# EasyEDA Pro project ProDoc_TwinWave_2026-01-11.epro

# Schematic TwinWave
Board Name: TwinWave; Create Date: 2025-08-05; Page Name: Main; Project Name: TwinWave - WiFi & SubGHz Module; Schematic Name: TwinWave; Update Date: 2026-01-07; Company: Created by 0xM4R71N; Drawn: 0xM4R71N; Page Size: A3; Reviewed: 0xM4R71N; Version: V2.1
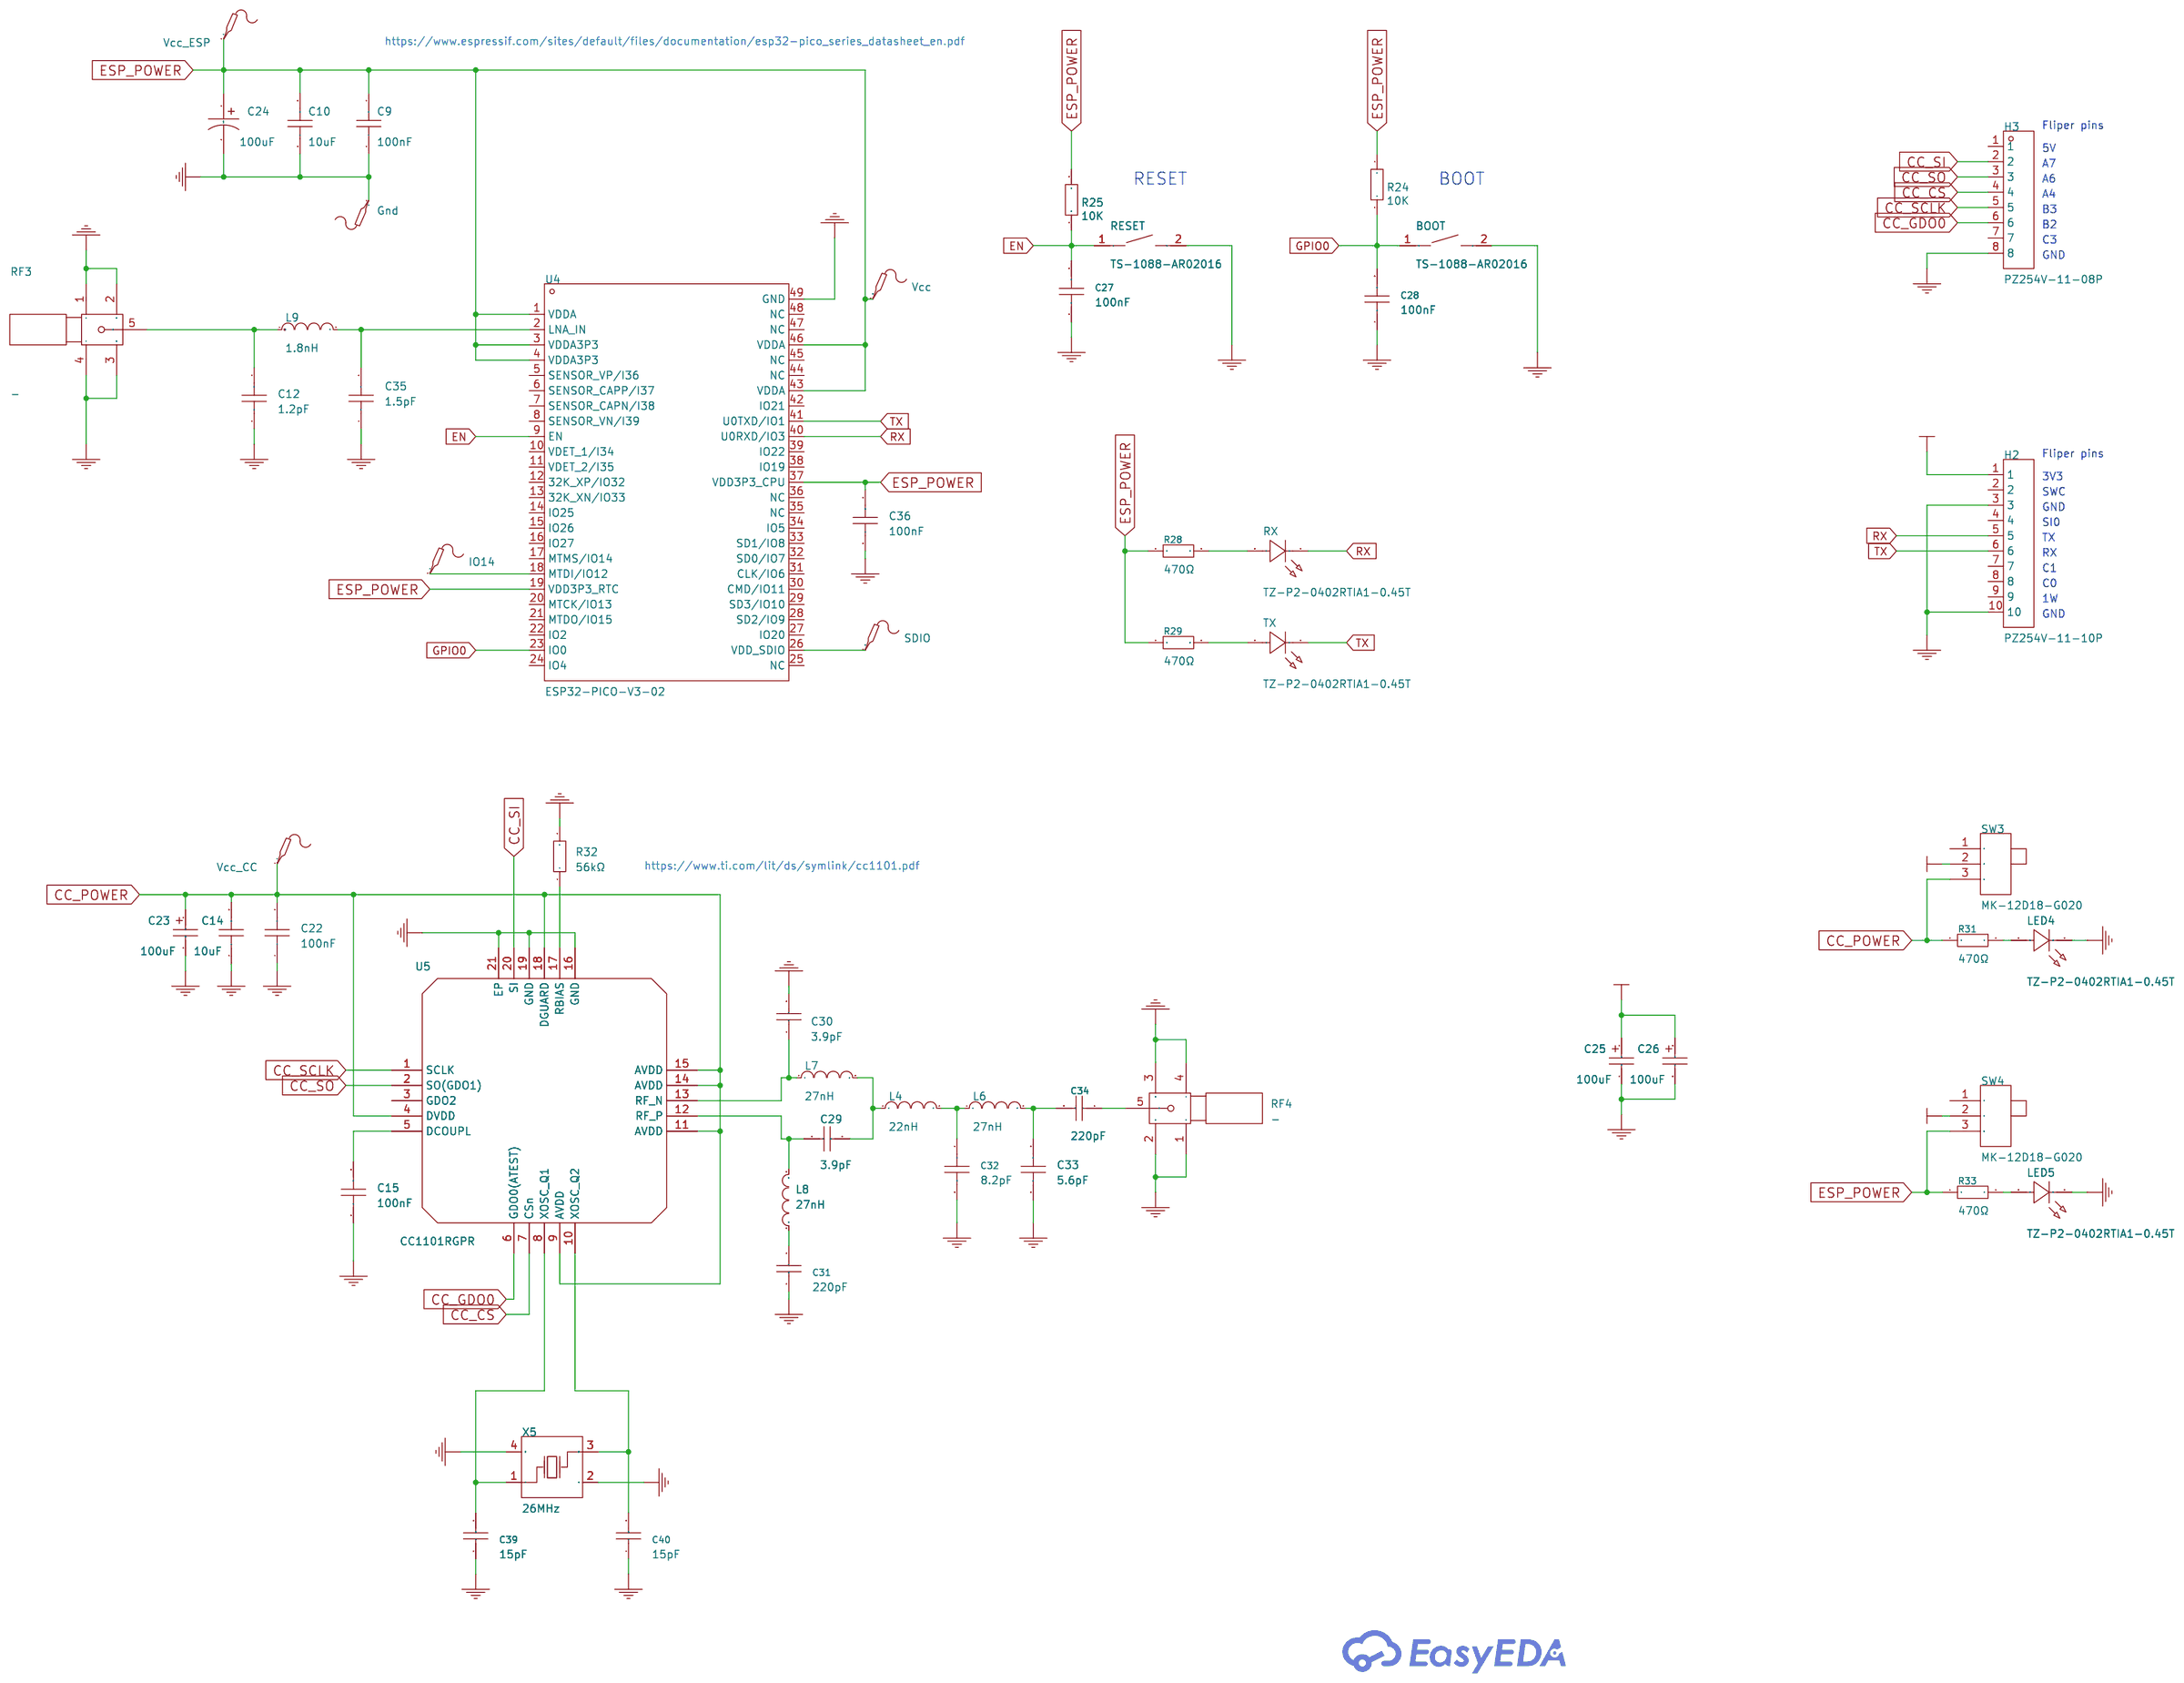
[diagram p0: schematic sheet]

## Parts
BOOT  TS-1088-AR02016  [SW-SMD_L3.9-W3.0-P4.45]
C9  100nF  [C0603]
C10  10uF  [C0603]
C12  1.2pF  [C0201]
C14  10uF  [C0603]
C15  100nF  [C0603]
C22  100nF  [C0603]
C23  100uF  [CASE-B_3528]
C24  100uF  [CASE-B_3528-1]
C25  100uF  [CASE-B_3528]
C26  100uF  [CASE-B_3528]
C27  100nF  [C0402]
C28  100nF  [C0402]
C29  3.9pF  [C0402]
C30  3.9pF  [C0402]
C31  220pF  [C0402]
C32  8.2pF  [C0402]
C33  5.6pF  [C0402]
C34  220pF  [C0402]
C35  1.5pF  [C0201]
C36  100nF  [C0603]
C39  15pF  [C0402]
C40  15pF  [C0402]
Gnd  -  [Test-Point-0.5mm]
H2  PZ254V-11-10P  [HDR-TH_10P-P2.54-V-M]
H3  PZ254V-11-08P  [HDR-TH_8P-P2.54-V-M]
IO14  -  [Test-Point-0.5mm]
L4  22nH  [L0402]
L6  27nH  [L0402-RD]
L7  27nH  [L0402-RD]
L8  27nH  [L0402-RD]
L9  1.8nH  [L0201-RD]
LED4  TZ-P2-0402RTIA1-0.45T  [LED0402-RD_RED]
LED5  TZ-P2-0402RTIA1-0.45T  [LED0402-RD_RED]
R24  10K  [R0603]
R25  10K  [R0603]
R28  470Ω  [R0402]
R29  470Ω  [R0402]
R31  470Ω  [R0402]
R32  56kΩ  [R0402]
R33  470Ω  [R0402]
RESET  TS-1088-AR02016  [SW-SMD_L3.9-W3.0-P4.45]
RF3  -  [SMA-SMD_BWSMA-KE-P001]
RF4  -  [SMA-SMD_BWSMA-KE-P001]
RX  TZ-P2-0402RTIA1-0.45T  [LED0402-RD_RED]
SDIO  -  [Test-Point-0.5mm]
SW3  MK-12D18-G020  [SW-TH_MK-12D18-G040]
SW4  MK-12D18-G020  [SW-TH_MK-12D18-G040]
TX  TZ-P2-0402RTIA1-0.45T  [LED0402-RD_RED]
U4  ESP32-PICO-V3-02  [QFN-48_L7.0-W7.0-P0.50-BL-EP5.1]
U5  CC1101RGPR  [QFN-20_L4.0-W4.0-P0.5-TL-EP]
Vcc  -  [Test-Point-0.5mm]
Vcc_CC  -  [Test-Point-0.5mm]
Vcc_ESP  -  [Test-Point-0.5mm]
X5  26MHz  [CRYSTAL-SMD_4P-L3.2-W2.5-BL]

## Library data of the parts
BOOT RESET = TS-1088-AR02016: Circuit:SPST Actuator Style:Round Button Operating Force:160gf Mounting Style:Brick nogging Switch Length:4mm Switch Width:3mm Switch Height:2mm Strike Gundam:不带 Contact Current:50mA Voltage Rating (DC):12V Insulation Resistance:100MΩ Actuator/Cap Color:B; LCSC Part Name: 4*3*2mm 立贴 轻触开关; Supplier Part: C720477; Manufacturer: XUNPU(讯普); Supplier Footprint: SMD; JLCPCB Part Class: Basic Part; Datasheet: https://atta.szlcsc.com/upload/public/pdf/source/20200810/C720475_60D09DD6C54279ADDB2DC25100F1CC11.pdf; Supplier: LCSC; Circuit: SPST; Actuator Style: Round Button; Operating Force: 160gf; Mounting Style: Brick nogging; Switch Length: 4mm; Switch Width: 3mm; Switch Height: 2mm; Strike Gundam: 不带; Contact Current: 50mA; Voltage Rating (DC): 12V; Insulation Resistance: 100MΩ; Actuator/Cap Color: Black; Pin Style: SMDSplicing; Mechanical Life: 10万次; Operating Temperature: -30℃~+80℃
C9 C15 C22 C36 = CC0603KRX7R9BB104: Capacitance:100nF Tolerance:±10% Tolerance:±10% Voltage Rating:50V Temperature Coefficient:X7R; LCSC Part Name: 100nF ±10% 50V; Supplier Part: C14663; Manufacturer: YAGEO(国巨); Supplier Footprint: 0603; JLCPCB Part Class: Basic Part; Datasheet: https://atta.szlcsc.com/upload/public/pdf/source/20250214/096C4C206003071F5D32E5F0D8E7F8DF.pdf; Supplier: LCSC; Tolerance: ±10%; Voltage Rating: 50V; Temperature Coefficient: X7R
C10 C14 = CL10A106MP8NNNC: Capacitance: Tolerance:±20% Tolerance:±20% Voltage Rated: Temperature Coefficient:; LCSC Part Name: 10uF ±20% 10V; Supplier Part: C85713; Manufacturer: SAMSUNG(三星); Supplier Footprint: 0603; JLCPCB Part Class: Extended Part; Datasheet: https://atta.szlcsc.com/upload/public/pdf/source/20160218/1457707763339.pdf; Supplier: LCSC; Tolerance: ±20%
C12 = GRM0335C1H1R2BA01D: Capacitance: Voltage Rated: Temperature Coefficient:; LCSC Part Name: 1.2pF 50V; Supplier Part: C85895; Manufacturer: muRata(村田); Supplier Footprint: 0201; JLCPCB Part Class: Extended Part; Datasheet: https://atta.szlcsc.com/upload/public/pdf/source/20200305/C490387_23319AE8C154DEB24C505E6C82A8106A.pdf; Supplier: LCSC
C23 C25 C26 = TAJB107K006RNJ: Capacitance:100uF Tolerance:±10% Tolerance:±10% Voltage Rating:6.3V Equivalent Series Resistance(ESR):1.7Ω@100kHz Operating Temperature:-55℃~+125℃ Operating Temperature:-55℃~+125℃; LCSC Part Name: 100uF ±10% 6.3V; Supplier Part: C16133; Manufacturer: Kyocera AVX; Supplier Footprint: CASE-B-3528-21(mm); JLCPCB Part Class: Basic Part; Supplier: LCSC; Tolerance: ±10%; Voltage Rating: 6.3V; Equivalent Series Resistance(ESR): 1.7Ω@100kHz; Operating Temperature: -55℃~+125℃
C24 = TPSB107K006R0250: Capacitance:100uF Tolerance:±10% Tolerance:±10% Voltage Rating:6.3V Current - Leakage:- Ripple Current:- Equivalent Series Resistance(ESR):250mΩ Operating Temperature:-55℃~+125℃ Operating Temperature:-55℃~+125℃; LCSC Part Name: 100uF ±10% 6.3V; Supplier Part: C597710; Manufacturer: Kyocera AVX; Supplier Footprint: 1210; JLCPCB Part Class: Extended Part; Supplier: LCSC; Tolerance: ±10%; Voltage Rating: 6.3V; Equivalent Series Resistance(ESR): 250mΩ; Operating Temperature: -55℃~+125℃
C27 C28 = CC0402KRX7R7BB104: Capacitance: Tolerance:±10% Tolerance:±10% Voltage Rated: Temperature Coefficient:; LCSC Part Name: 100nF ±10% 16V; Supplier Part: C60474; Manufacturer: YAGEO(国巨); Supplier Footprint: 0402; JLCPCB Part Class: Extended Part; Datasheet: https://atta.szlcsc.com/upload/public/pdf/source/20211223/9278FD768280B81DDBEF48FA36411A03.pdf; Supplier: LCSC; Tolerance: ±10%
C29 C30 = 0402CG3R9C500NT: Capacitance: Voltage Rated: Temperature Coefficient:; LCSC Part Name: 3.9pF 50V; Supplier Part: C1566; Manufacturer: FH(风华); Supplier Footprint: 0402; JLCPCB Part Class: Extended Part; Datasheet: https://atta.szlcsc.com/upload/public/pdf/source/20200305/C486355_26A10D38EF8C2A5C37091D0039909270.pdf; Supplier: LCSC
C31 C34 = CC0402JRNPO9BN221: Capacitance:220pF Tolerance:±5% Tolerance:±5% Voltage Rating:50V Temperature Coefficient:NP0; LCSC Part Name: 220pF ±5% 50V; Supplier Part: C107001; Manufacturer: YAGEO(国巨); Supplier Footprint: 0402; JLCPCB Part Class: Extended Part; Datasheet: https://item.szlcsc.com/datasheet/CC0402JRNPO9BN221/108217.html; Supplier: LCSC; Tolerance: ±5%; Voltage Rating: 50V; Temperature Coefficient: NP0
C32 = CC0402BRNPO9BN8R2: Capacitance: Voltage Rated: Temperature Coefficient:; LCSC Part Name: 8.2pF 50V; Supplier Part: C327205; Manufacturer: YAGEO(国巨); Supplier Footprint: 0402; JLCPCB Part Class: Extended Part; Datasheet: https://atta.szlcsc.com/upload/public/pdf/source/20181031/C327205_F4131002D46BACA84D84738D479C8C01.pdf; Supplier: LCSC
C33 = CC0402BRNPO9BN5R6: Capacitance: Voltage Rated: Temperature Coefficient:; LCSC Part Name: 5.6pF 50V ±0.1pF; Supplier Part: C505468; Manufacturer: YAGEO(国巨); Supplier Footprint: 0402; JLCPCB Part Class: Extended Part; Datasheet: https://atta.szlcsc.com/upload/public/pdf/source/20181031/C327223_EC1948F098034DE992154616911912CF.pdf; Supplier: LCSC
C35 = GRM0335C1H1R5BA01D: Capacitance: Voltage Rated: Temperature Coefficient:; LCSC Part Name: 1.5pF 50V; Supplier Part: C161414; Manufacturer: muRata(村田); Supplier Footprint: 0201; JLCPCB Part Class: Extended Part; Datasheet: https://atta.szlcsc.com/upload/public/pdf/source/20180122/C161414_15166126300931291272.pdf; Supplier: LCSC
C39 C40 = CC0402JRNPO9BN150: Capacitance: Tolerance:±5% Tolerance:±5% Voltage Rated: Temperature Coefficient:; LCSC Part Name: 15pF ±5% 50V; Supplier Part: C106997; Manufacturer: YAGEO(国巨); Supplier Footprint: 0402; JLCPCB Part Class: Extended Part; Datasheet: https://atta.szlcsc.com/upload/public/pdf/source/20170914/C128857_1505359892143968080.pdf; Supplier: LCSC; Tolerance: ±5%
Gnd IO14 SDIO Vcc Vcc_CC Vcc_ESP = Test-Point: Test Point 测试点
H2 = PZ254V-11-10P: Pin Structure:1x10P Pitch:2.54mm Row Spacing:- Circluar Pins/Square Pins:Policy Mounting Type:Straight Number of Rows:Single Row Number of Pins:10P Current Rating:- Voltage Rating (Max):- Length of Mating Pin:6mm Insulation Height:2.5mm Length of End Conn; LCSC Part Name: 1x10P 间距:2.54mm 方针 直插; Supplier Part: C492409; Manufacturer: XFCN(兴飞); Supplier Footprint: 插件,P=2.54mm; JLCPCB Part Class: Extended Part; Datasheet: https://atta.szlcsc.com/upload/public/pdf/source/20200309/C492409_129C9431BDD62EBBBD0A643B6AAB9FBD.pdf; Supplier: LCSC; Pin Structure: 1x10P; Pitch: 2.54mm; Circluar Pins/Square Pins: Policy; Mounting Type: Straight; Number of Rows: Single Row; Number of Pins: 10P; Length of Mating Pin: 6mm; Insulation Height: 2.5mm; Length of End Connection Pin: 3mm; Contact Material: Brass; Operating Temperature: -40℃~+105℃; Color: Black
H3 = PZ254V-11-08P: Pin Structure:1x8P Pitch:2.54mm Row Spacing:- Circluar Pins/Square Pins:Square Pins Mounting Type:Straight Number of Rows:Plugin Number of Pins:8P Current Rating (Max):- Voltage Rating (Max):- Length of Mating Pin:6mm Insulation Height:2.5mm Length of End; LCSC Part Name: 间距:2.54mm 1x8P 直插 方针; Supplier Part: C492407; Manufacturer: XFCN(兴飞); Supplier Footprint: 插件,P=2.54mm; JLCPCB Part Class: Extended Part; Datasheet: https://atta.szlcsc.com/upload/public/pdf/source/20200309/C492407_83A6FB26A2233368EDB9516968EC6149.pdf; Supplier: LCSC; Pin Structure: 1x8P; Pitch: 2.54mm; Circluar Pins/Square Pins: Square Pins; Mounting Type: Straight; Number of Rows: Plugin; Number of Pins: 8P; Length of Mating Pin: 6mm; Insulation Height: 2.5mm; Length of End Connection Pin: 3mm; Operating Temperature Range: -40℃~+105℃; Color: Black
L4 = LQG15HS22NJ02D: Inductance: Tolerance:±5% Tolerance:±5% Rated Current: Saturation Current (Isat):- DC Resistance (DCR): Q @ Freq:8@100MHz Frequency - Self Resonant: Ratings:; LCSC Part Name: 22nH ±5%; Supplier Part: C12670; Manufacturer: muRata(村田); Supplier Footprint: 0402; JLCPCB Part Class: Extended Part; Datasheet: https://atta.szlcsc.com/upload/public/pdf/source/20180612/C185484_14F678484DDF036353DC67B6265A9221.pdf; Supplier: LCSC; Tolerance: ±5%; Q @ Freq: 8@100MHz
L6-L8 = LQG15HS27NJ02D: Inductance:27nH Tolerance:±5% Tolerance:±5% Current Rating:350mA Current - Saturation (Isat):- DC Resistance(DCR):460mΩ Q @ Frequency:8@100MHz Frequency - Self Resonant:1.7GHz Ratings:-; LCSC Part Name: 27nH ±5%; Supplier Part: C12669; Manufacturer: muRata(村田); Supplier Footprint: 0402; JLCPCB Part Class: Extended Part; Datasheet: https://atta.szlcsc.com/upload/public/pdf/source/20170810/C86059_1502335402466879997.pdf; Supplier: LCSC; Tolerance: ±5%; Current Rating: 350mA; DC Resistance(DCR): 460mΩ; Q @ Frequency: 8@100MHz; Frequency - Self Resonant: 1.7GHz
L9 = LQP03TN1N8B02D: Inductance: Tolerance:- Tolerance:- Rated Current: Saturation Current (Isat):- DC Resistance (DCR): Q @ Freq:14@500MHz Frequency - Self Resonant: Ratings:; Supplier Part: C98040; Manufacturer: muRata(村田); Supplier Footprint: 0201; JLCPCB Part Class: Extended Part; Datasheet: https://atta.szlcsc.com/upload/public/pdf/source/20200107/C157592_7FF58F85BAEF0D918ADFA12AEC0AEBA8.pdf; Supplier: LCSC; Q @ Freq: 14@500MHz
LED4 LED5 RX TX = TZ-P2-0402RTIA1-0.45T: Illumination Color:Red Power(Watts):60mW Forward Current:- Wavelength - Dominant:620nm~625nm Wavelength - Dominant:620nm~625nm Peak Wavelength:633nm Diode Configuration:- Lens Color:Water Clear Color Temperature:- Color Temperature:- Viewing Angle:120° Mo; LCSC Part Name: 红灯; Supplier Part: C779449; Manufacturer: TUOZHAN(拓展光电); Supplier Footprint: 0402; JLCPCB Part Class: Extended Part; Datasheet: https://atta.szlcsc.com/upload/public/pdf/source/20200925/C779449_A9A3CFAD739F0709457D250F53980B4F.pdf; Supplier: LCSC; Illumination Color: Red; Power(Watts): 60mW; Wavelength - Dominant: 620nm~625nm; Peak Wavelength: 633nm; Lens Color: Water Clear; Viewing Angle: 120°; Operating Temperature: -40℃~+80℃
R24 R25 = 10K: Supplier: LCSC; Manufacturer: YAGEO(国巨); Manufacturer Part: RC0603DR-0710KL; Supplier Part: C137819; JLCPCB Part Class: Extended Part; Resistance: 10kΩ
R28 R29 R31 R33 = 0402WGF4700TCE: Type:Thick Film Resistors Resistance: Tolerance:±1% Tolerance:±1% Power(Watts): Overload Voltage (Max): Temperature Coefficient:±100ppm/℃ Temperature Coefficient:±100ppm/℃ Operating Temperature Range:-55℃~+155℃ Operating Temperature Range:-55℃~+155℃; LCSC Part Name: 470Ω ±1% 62.5mW 厚膜电阻; Supplier Part: C25117; Manufacturer: UNI-ROYAL(厚声); Supplier Footprint: 0402; JLCPCB Part Class: Basic Part; Datasheet: https://atta.szlcsc.com/upload/public/pdf/source/20200306/C422600_1E6D84923E4A46A82E41ADD87F860B5C.pdf; Supplier: LCSC; Type: Thick Film Resistors; Tolerance: ±1%; Temperature Coefficient: ±100ppm/℃; Operating Temperature Range: -55℃~+155℃
R32 = 0402WGF5602TCE: Type:Thick Film Resistors Resistance:56kΩ Tolerance:±1% Tolerance:±1% Power(Watts): Overload Voltage (Max): Temperature Coefficient:±100ppm/℃ Temperature Coefficient:±100ppm/℃ Operating Temperature Range:-55℃~+155℃ Operating Temperature Range:-55℃~+155℃; LCSC Part Name: 56kΩ ±1% 62.5mW 厚膜电阻; Supplier Part: C25796; Manufacturer: UNI-ROYAL(厚声); Supplier Footprint: 0402; JLCPCB Part Class: Extended Part; Datasheet: https://atta.szlcsc.com/upload/public/pdf/source/20200306/C422600_1E6D84923E4A46A82E41ADD87F860B5C.pdf; Supplier: LCSC; Type: Thick Film Resistors; Tolerance: ±1%; Temperature Coefficient: ±100ppm/℃; Operating Temperature Range: -55℃~+155℃
RF3 RF4 = BWSMA-KE-P001: Connector Type:Board-End Interface:Inner Hole Number of Ports:1 Interface Diameter:5.2mm Interface Length/Height:- Frequency:- RF Series:SMA Impedance:50Ω Style:Staggered pins Operating Temperature Range:- Operating Temperature Range:-; LCSC Part Name: 内孔 SMA 偏脚; Supplier Part: C496550; Manufacturer: BAT WIRELESS(蝙蝠无线); Supplier Footprint: SMD; JLCPCB Part Class: Extended Part; Datasheet: https://atta.szlcsc.com/upload/public/pdf/source/20240320/28FD502871C976DFF213ABFCF2A0ED51.pdf; Supplier: LCSC; Connector Type: Board-End; Interface: Inner Hole; Number of Ports: 1; Interface Diameter: 5.2mm; RF Series: SMA; Impedance: 50Ω; Style: Staggered pins
SW3 SW4 = MK-12D18-G020: LCSC Part Name: 边三脚微型拨动开关G4; Supplier Part: C3019727; Manufacturer: G-Switch(品赞); Supplier Footprint: 插件; JLCPCB Part Class: Extended Part; Datasheet: https://atta.szlcsc.com/upload/public/pdf/source/20201201/C963202_825FB742C5BA766BED52E1DDA96DE5A3.pdf; Supplier: LCSC
U4 = ESP32-PICO-V3-02: Supplier Part: C908392; Manufacturer: ESPRESSIF(乐鑫); Supplier Footprint: QFN-48-EP(7x7); JLCPCB Part Class: Extended Part; Datasheet: https://atta.szlcsc.com/upload/public/pdf/source/20220113/3D65B6E312885C5F83859648756380C1.pdf; Supplier: LCSC
U5 = CC1101RGPR: Frequency Range:387MHz~464MHz；300MHz~348MHz；779MHz~928MHz Frequency Range:387MHz~464MHz；300MHz~348MHz；779MHz~928MHz Interface:SPI Voltage - Supply:1.8V~3.6V Voltage - Supply:1.8V~3.6V Applications:ISM Output Power:12dBm Data Rate:500Kbps Current Of Transm; LCSC Part Name: 低功率射频收发器 专为极低功耗无线应用设计; Supplier Part: C29953; Manufacturer: TI(德州仪器); Supplier Footprint: QFN-20-EP(4x4); JLCPCB Part Class: Extended Part; Datasheet: https://www.ti.com/cn/lit/gpn/cc1101; Supplier: LCSC; Frequency Range: 387MHz~464MHz；300MHz~348MHz；779MHz~928MHz; Interface: SPI; Voltage - Supply: 1.8V~3.6V; Applications: ISM; Output Power: 12dBm; Data Rate: 500Kbps; Current Of Transmitting: 34.2mA; Receive Current: 15.7mA; Typical Application Frequency: 433MHz；315MHz；868MHz；915MHz; Operating Temperature: -40℃~+85℃
X5 = X322526MMB4SI: Type:Crystal Oscillator Frequency:26MHz Normal temperature Frequency Tolerance:±10ppm Normal temperature Frequency Tolerance:±10ppm Load Capacitance:10pF Frequency Stability:±20ppm Frequency Stability:±20ppm Operating Temperature:-40℃~+85℃ Operating Tempe; LCSC Part Name: YSX321SL 26MHZ 4P 3225 10PF ±10PPM -40~85℃ (±20PPM); Supplier Part: C15192; Manufacturer: YXC(扬兴晶振); Supplier Footprint: SMD3225-4P; JLCPCB Part Class: Extended Part; Datasheet: https://item.szlcsc.com/datasheet/X322526MMB4SI/15866.html; Supplier: LCSC; Type: Crystal Oscillator; Normal temperature Frequency Tolerance: ±10ppm; Load Capacitance: 10pF; Frequency Stability: ±20ppm; Operating Temperature: -40℃~+85℃

## Nets
3V3: C25.1 C26.1 H2.1 SW3.2 SW4.2
GND: BOOT.2 C9.1 C10.1 C12.1 C14.1 C15.1 C22.1 C23.2 C24.2 C25.2 C26.2 C27.1 C28.1 C30.2 C31.1 C32.2 C33.1 C35.1 C36.1 C39.1 C40.1 Gnd.1 H2.3 H2.10 H3.8 LED4.1(K) LED5.1(K) R32.2 RESET.2 RF3.1 RF3.2 RF3.3 RF3.4 RF4.1 RF4.2 RF4.3 RF4.4 U4.49(GND) U5.16(GND) U5.19(GND) U5.21(EP) X5.2(GND) X5.4(GND)
CC_CS: H3.4 U5.7(CSn)
CC_GDO0: H3.6 U5.6(GDO0(ATEST))
CC_POWER: C14.2 C22.2 C23.1 R31.1 SW3.3 U5.4(DVDD) U5.9(AVDD) U5.11(AVDD) U5.14(AVDD) U5.15(AVDD) U5.18(DGUARD) Vcc_CC.1
CC_SCLK: H3.5 U5.1(SCLK)
CC_SI: H3.2 U5.20(SI)
CC_SO: H3.3 U5.2(SO(GDO1))
EN: C27.2 R25.1 RESET.1 U4.9(EN)
ESP_POWER: C9.2 C10.2 C24.1 C36.2 R24.2 R25.2 R28.1 R29.1 R33.1 SW4.3 U4.1(VDDA) U4.3(VDDA3P3) U4.4(VDDA3P3) U4.19(VDD3P3_RTC) U4.37(VDD3P3_CPU) U4.43(VDDA) U4.46(VDDA) Vcc.1 Vcc_ESP.1
GPIO0: BOOT.1 C28.2 R24.1 U4.23(IO0)
RX: H2.5 RX.1(K) U4.40(U0RXD/IO3)
TX: H2.6 TX.1(K) U4.41(U0TXD/IO1)
$1N19: R28.2 RX.2(A)
$1N20: R29.2 TX.2(A)
$1N3299: C12.2 L9.1 RF3.5
$1N3304: C35.2 L9.2 U4.2(LNA_IN)
$1N4251: LED4.2(A) R31.2
$1N4890: C39.2 U5.8(XOSC_Q1) X5.1(OSC1)
$1N4895: C40.2 U5.10(XOSC_Q2) X5.3(OSC2)
$1N5338: R32.1 U5.17(RBIAS)
$1N5430: C15.2 U5.5(DCOUPL)
$1N5564: C30.1 L7.1 U5.13(RF_N)
$1N5647: C29.2 L4.1 L7.2
$1N5692: C32.1 L4.2 L6.1
$1N5734: C29.1 L8.2 U5.12(RF_P)
$1N5764: C33.2 C34.2 L6.2
$1N6120: C34.1 RF4.5
$1N6387: LED5.2(A) R33.2
$1N20620: C31.2 L8.1
$1N27764: SDIO.1 U4.26(VDD_SDIO)
$1N27806: IO14.1 U4.18(MTDI/IO12)

Not connected (* = marked no-connect by the designer): H2 2 4 7 8 9; H3 1 7; SW3 1; SW4 1; U4 5(SENSOR_VP/I36) 6(SENSOR_CAPP/I37) 7(SENSOR_CAPN/I38) 8(SENSOR_VN/I39) 10(VDET_1/I34) 11(VDET_2/I35) 12(32K_XP/IO32) 13(32K_XN/IO33) 14(IO25) 15(IO26) 16(IO27) 17(MTMS/IO14) 20(MTCK/IO13) 21(MTDO/IO15) 22(IO2) 24(IO4) 25(NC) 27(IO20) 28(SD2/IO9) 29(SD3/IO10) 30(CMD/IO11) 31(CLK/IO6) 32(SD0/IO7) 33(SD1/IO8) 34(IO5) 35(NC) 36(NC) 38(IO19) 39(IO22) 42(IO21) 44(NC) 45(NC) 47(NC) 48(NC); U5 3(GDO2)

## Notes on the sheet
- https://www.espressif.com/sites/default/files/documentation/esp32-pico_series_datasheet_en.pdf
- Fliper pins
- 5V
- A7
- RESET
- BOOT
- A6
- A4
- B3
- B2
- C3
- GND
- Fliper pins
- 3V3
- SWC
- GND
- SI0
- RX
- TX
- C1
- C0
- 1W
- GND
- https://www.ti.com/lit/ds/symlink/cc1101.pdf

# Board PCB
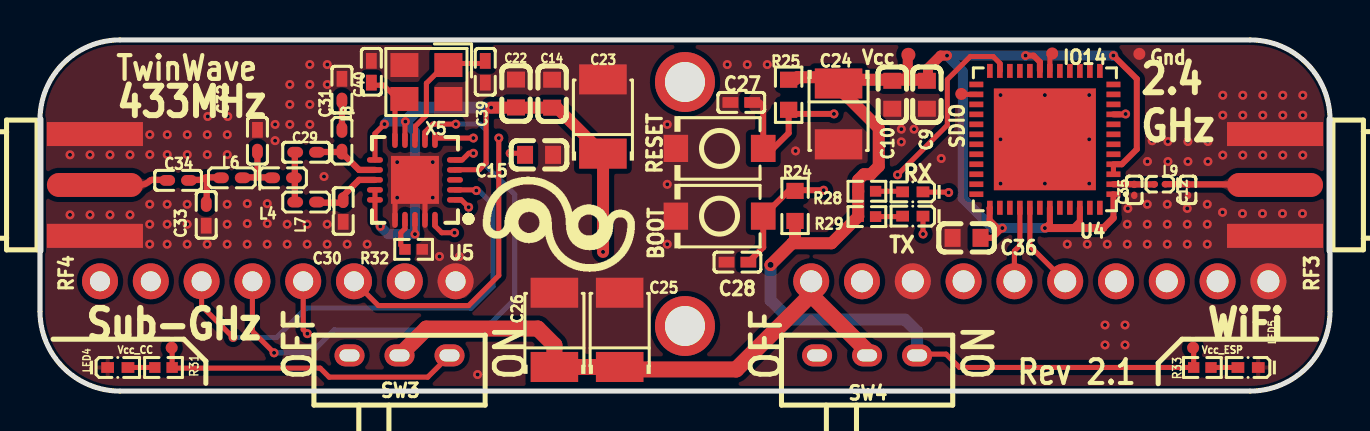
[diagram p1: board, top side]
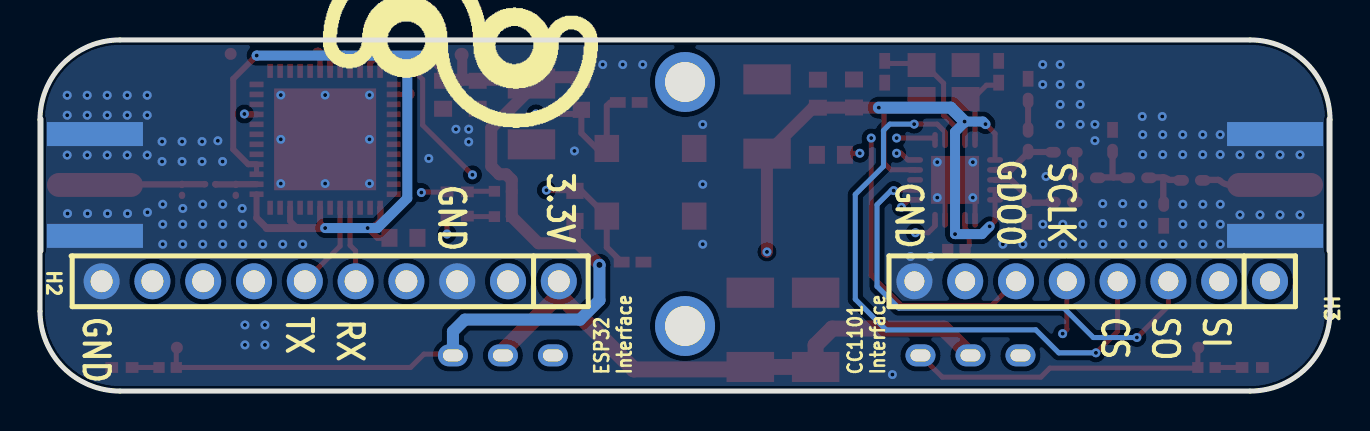
[diagram p2: board, bottom side, seen from below]

Outline 64.5 x 17.59 mm; copper layers: Top Layer, Inner1, Inner2, Bottom Layer. Coordinates in mm from the lower left corner of the outline.
Outline path: 0,13.59 0,4 arc(1.17,1.17) 4,0 60.5,0 arc(63.33,1.17) 64.5,4 64.5,13.59 arc(63.33,16.42) 60.5,17.59 4,17.59 arc(1.17,16.42) 0,13.59
Stack: Top Layer 0.035mm Outer layer thickness 1oz / Dielectric1 0.2104mm 7628 RC49% 8.6mil / Inner1 0.0152mm Inner layer thickness / Dielectric2 1.065mm 1.1mm H/HOZ Copper / Inner2 0.0152mm Inner layer thickness / Dielectric3 0.2104mm 7628 RC49% 8.6mil / Bottom Layer 0.035mm Outer layer thickness 1oz

## Design rules (mm)
template: Custom Config
spacing copperThickness1oz (default): track to track 0.102, other pairs 0.152 to 0.3
spacing copperThickness2oz: track to track 0.203, other pairs 0.152 to 0.3
track width copperThickness1oz (default): min 0.127, default 0.254, max 2.54
track width copperThickness2oz: min 0.203, default 0.254, max 2.54
differential pair differentialPair (default): width min 0.127, default 0.254, max 2.54; gap min 0.152, default 0.152
via viaSize (default): diameter min 0.45, default 0.45, max 10; hole min 0.2, default 0.2, max 6.3

## Placement (name value [footprint] x y rotation side)
BOOT  TS-1088-AR02016  [SW-SMD_L3.9-W3.0-P4.45]  33.98 8.76 180 top
C9  100nF  [C0603]  44.34 14.84 90 top
C10  10uF  [C0603]  42.62 14.84 90 top
C12  1.2pF  [C0201]  57.4 10.08 90 top
C14  10uF  [C0603]  25.61 14.9 270 top
C15  100nF  [C0603]  24.95 11.84 180 top
C22  100nF  [C0603]  23.8 14.91 270 top
C23  100uF  [CASE-B_3528]  28.15 13.75 90 top
C24  100uF  [CASE-B_3528-1]  39.93 13.88 270 top
C25  100uF  [CASE-B_3528]  28.98 3.07 90 top
C26  100uF  [CASE-B_3528]  25.72 3.07 90 top
C27  100nF  [C0402#2]  35.06 14.46 0 top
C28  100nF  [C0402#2]  34.87 6.46 0 top
C29  3.9pF  [C0402#3]  13.3 11.96 180 top
C30  3.9pF  [C0402#4]  15.16 9.02 270 top
C31  220pF  [C0402]  15.1 15.1 270 top
C32  8.2pF  [C0402#4]  10.87 12.54 90 top
C33  5.6pF  [C0402]  8.31 8.83 90 top
C34  220pF  [C0402#3]  6.9 10.56 0 top
C35  1.5pF  [C0201]  54.71 10.08 90 top
C36  100nF  [C0603]  46.33 7.68 0 top
C39  15pF  [C0402#2]  22.26 16 90 top
C40  15pF  [C0402#2]  16.57 16 270 top
Gnd  -  [Test-Point-0.5mm]  54.97 16.89 0 top
H2  PZ254V-11-10P  [HDR-TH_10P-P2.54-V-M]  49.99 5.5 0 bottom
H3  PZ254V-11-08P  [HDR-TH_8P-P2.54-V-M]  11.89 5.5 0 bottom
IO14  -  [Test-Point-0.5mm]  50.61 16.91 0 top
L4  22nH  [L0402]  12.15 10.68 180 top
L6  27nH  [L0402-RD]  9.59 10.68 180 top
L7  27nH  [L0402-RD]  13.3 9.47 180 top
L8  27nH  [L0402-RD]  15.1 12.54 270 top
L9  1.8nH  [L0201-RD]  55.99 10.36 180 top
LED4  TZ-P2-0402RTIA1-0.45T  [LED0402-RD_RED]  3.89 1.18 0 top
LED5  TZ-P2-0402RTIA1-0.45T  [LED0402-RD_RED]  60.4 1.18 180 top
NOREF  -  [Pad_e275]  32.25 15.48 0 top
NOREF#2  -  [Pad_e794]  32.25 3.26 0 top
R24  10K  [R0603]  37.75 9.28 270 top
R25  10K  [R0603]  37.43 14.84 90 top
R28  470Ω  [R0402]  41.35 10.01 0 top
R29  470Ω  [R0402]  41.35 8.74 0 top
R31  470Ω  [R0402]  6.17 1.18 180 top
R32  56kΩ  [R0402]  18.68 7.1 0 top
R33  470Ω  [R0402]  58.12 1.18 0 top
RESET  TS-1088-AR02016  [SW-SMD_L3.9-W3.0-P4.45]  33.98 12.16 180 top
RF3  -  [SMA-SMD_BWSMA-KE-P001]  61.75 10.33 0 top
RF4  -  [SMA-SMD_BWSMA-KE-P001]  2.75 10.33 180 top
RX  TZ-P2-0402RTIA1-0.45T  [LED0402-RD_RED]  43.64 9.98 180 top
SDIO  -  [Test-Point-0.5mm]  46.07 14.89 0 top
SW3  MK-12D18-G020  [SW-TH_MK-12D18-G040]  17.98 1.79 0 top
SW4  MK-12D18-G020  [SW-TH_MK-12D18-G040]  41.35 1.79 0 top
TX  TZ-P2-0402RTIA1-0.45T  [LED0402-RD_RED]  43.64 8.76 180 top
U4  ESP32-PICO-V3-02  [QFN-48_L7.0-W7.0-P0.50-BL-EP5.1]  50.24 12.61 90 top
U5  CC1101RGPR  [QFN-20_L4.0-W4.0-P0.5-TL-EP]  18.75 10.58 180 top
Vcc  -  [Test-Point-0.5mm#2]  43.42 16.85 0 top
Vcc_CC  -  [Test-Point-0.5mm]  6.58 2.17 0 top
Vcc_ESP  -  [Test-Point-0.5mm]  57.66 2.17 0 top
X5  26MHz  [CRYSTAL-SMD_4P-L3.2-W2.5-BL]  19.32 15.48 180 top

## Footprints (pads in the part's own frame, mm; a bottom-side part is the same pattern mirrored in y, then rotated)
C0201
  oval 0.368x0.324 smd: 1(-0.275,0) 2(0.275,0)
C0402
  rect 0.79x0.54 smd: 1(-0.545,0)
  oval 0.79x0.54 smd: 2(0.545,0)
C0402#2
  rect 0.79x0.54 smd: 1(-0.545,0) 2(0.545,0)
C0402#3
  oval 0.79x0.54 smd: 1(-0.545,0) 2(0.545,0)
C0402#4
  oval 0.79x0.54 smd: 1(-0.545,0)
  rect 0.79x0.54 smd: 2(0.545,0)
C0603
  rect 0.8x0.9 smd: 1(-0.7,0) 2(0.7,0)
CASE-B_3528
  rect 1.506x2.376 smd: 1(-1.861,0) 2(1.861,0)
CASE-B_3528-1
  rect 1.506x2.376 smd: 1(-1.524,0) 2(1.524,0)
CRYSTAL-SMD_4P-L3.2-W2.5-BL
  rect 1.4x1.2 smd: 1(-1.1,-0.85) 2(1.1,-0.85) 3(1.1,0.85) 4(-1.1,0.85)
HDR-TH_8P-P2.54-V-M
  round 1.8 hole 1: 1(-8.89,0) 2(-6.35,0) 3(-3.81,0) 4(-1.27,0) 5(1.27,0) 6(3.81,0) 7(6.35,0) 8(8.89,0)
HDR-TH_10P-P2.54-V-M
  round 1.8 hole 1.1: 1(-11.43,0) 2(-8.89,0) 3(-6.35,0) 4(-3.81,0) 5(-1.27,0) 6(1.27,0) 7(3.81,0) 8(6.35,0) 9(8.89,0) 10(11.43,0)
L0201-RD
  oval 0.368x0.324 smd: 1(-0.275,0) 2(0.275,0)
L0402
  oval 0.79x0.54 smd: 1(-0.545,0) 2(0.545,0)
L0402-RD
  oval 0.79x0.54 smd: 1(-0.545,0) 2(0.545,0)
LED0402-RD_RED
  rect 0.636x0.54 smd: 1(-0.508,0) 2(0.508,0)
Pad_e275
  round 3 hole 2: 1(0,0)
Pad_e794
  round 3 hole 2: 1(0,0)
QFN-20_L4.0-W4.0-P0.5-TL-EP
  oval 0.8x0.28 smd: 1(-2,1) 2(-2,0.5) 3(-2,0) 4(-2,-0.5) 5(-2,-1) 11(2,-1) 12(2,-0.5) 13(2,0) 14(2,0.5) 15(2,1)
  oval 0.28x0.8 smd: 6(-1,-2) 7(-0.5,-2) 8(0,-2) 9(0.5,-2) 10(1,-2) 16(1,2) 17(0.5,2) 18(0,2) 19(-0.5,2) 20(-1,2)
  rect 2.4x2.4 smd: 21(0,0)
QFN-48_L7.0-W7.0-P0.50-BL-EP5.1
  rect 0.28x0.7 smd: 1(-2.75,-3.428) 2(-2.25,-3.428) 3(-1.75,-3.428) 4(-1.25,-3.428) 5(-0.75,-3.428) 6(-0.25,-3.428) 7(0.25,-3.428) 8(0.75,-3.428) 9(1.25,-3.428) 10(1.75,-3.428) 11(2.25,-3.428) 12(2.75,-3.428) 25(2.75,3.428) 26(2.25,3.428) 27(1.75,3.428) 28(1.25,3.428) 29(0.75,3.428) 30(0.25,3.428) 31(-0.25,3.428) 32(-0.75,3.428) 33(-1.25,3.428) 34(-1.75,3.428) 35(-2.25,3.428) 36(-2.75,3.428)
  rect 0.7x0.28 smd: 13(3.428,-2.75) 14(3.428,-2.25) 15(3.428,-1.75) 16(3.428,-1.25) 17(3.428,-0.75) 18(3.428,-0.25) 19(3.428,0.25) 20(3.428,0.75) 21(3.428,1.25) 22(3.428,1.75) 23(3.428,2.25) 24(3.428,2.75) 37(-3.428,2.75) 38(-3.428,2.25) 39(-3.428,1.75) 40(-3.428,1.25) 41(-3.428,0.75) 42(-3.428,0.25) 43(-3.428,-0.25) 44(-3.428,-0.75) 45(-3.428,-1.25) 46(-3.428,-1.75) 47(-3.428,-2.25) 48(-3.428,-2.75)
  rect 5.1x5.1 smd: 49(0,0)
R0402
  rect 0.566x0.54 smd: 1(-0.433,0) 2(0.433,0)
R0603
  rect 0.806x0.864 smd: 1(-0.753,0) 2(0.753,0)
SMA-SMD_BWSMA-KE-P001
  rect 4.8x1.2 smd: 1(0,-2.55) 2(0,2.55)
  rect 4.8x1.2 smd far side: 3(0,2.55) 4(0,-2.55)
  oval 4.8x1.2 smd: 5(0,0)
SW-SMD_L3.9-W3.0-P4.45
  rect 1.23x1.36 smd: 1(-2.185,0) 2(2.185,0)
SW-TH_MK-12D18-G040
  oval 1.5x1.1 hole 1x0.6: 1(-2.5,0) 2(0,0) 3(2.5,0)
Test-Point-0.5mm
  round 0.6 smd: 1(0,0)
Test-Point-0.5mm#2
  round 0.7 smd: 1(0,0)

## Nets
As in the schematic.

Pads without a net: H2 2 4 7 8 9; H3 1 7; NOREF 1; NOREF#2 1; SW3 1; SW4 1; U4 5 6 7 8 10 11 12 13 14 15 16 17 20 21 22 24 25 27 28 29 30 31 32 33 34 35 36 38 39 42 44 45 47 48; U5 3

## Via types
v1: diameter 0.45, hole 0.2, Top Layer to Bottom Layer, 163 vias
v2: diameter 0.61, hole 0.305, Top Layer to Bottom Layer, 1 via

## Routing (per net, layer and track width the routed paths; a pad name or vN(x,y) marks a point on that pad's centre or on a via; arc(x,y) is an arc through that point)
3V3: length 28.4
  Top Layer w0.8: SW3.2 19.32,3.13 24.89,3.13 25.72,2.3 C26.1 C25.1 29.11,1.08 34.81,1.08 38.56,4.84 38.56,4.81 ; 41.35,1.85 41.35,2.01 38.56,4.81 ; 38.56,4.81 38.56,4.76
GND: length 4.6
  Top Layer w0.254: U5.19 19.25,10.08 U5.21 18.75,10.52 17.75,9.52 U5.16
  vias: v1(1.5,11.84) v1(1.5,8.83) v1(2.5,11.84) v1(2.5,8.83) v1(3.5,11.84) v1(3.5,8.83) v1(4.5,11.84) v1(4.5,8.83) v1(5.49,12.85) v1(5.49,11.85) v1(5.49,9.36) v1(5.49,8.36) v1(5.49,7.36) v1(6.36,12.85) v1(6.36,11.85) v1(6.36,9.36) v1(6.36,8.36) v1(6.36,7.36) v1(7.36,12.85) v1(7.36,11.85) v1(7.36,9.36) v1(7.36,8.36) v1(7.36,7.36) v1(8.39,13.76) v1(8.36,12.85) v1(8.36,11.85) v1(8.36,7.36) v1(9.39,13.76) v1(9.36,12.85) v1(9.36,11.85) v1(9.36,9.36) v1(9.36,8.36) v1(9.36,7.36) v1(10.36,9.39) v1(10.36,8.39) v1(10.36,7.36) v1(11.36,9.39) v1(11.36,8.39) v1(11.36,7.36) v1(11.75,13.36) v1(11.75,12.55) v1(12.36,8.36) v1(12.36,7.36) v1(12.49,15.36) v1(12.49,14.36) v1(12.49,13.36) v1(13.36,8.36) v1(13.36,7.36) v1(13.49,16.36) v1(13.49,15.36) v1(13.49,14.36) v1(13.49,13.36) v1(14.2,10.75) v1(14.36,16.36) v1(14.36,15.36) v1(14.36,8.36) v1(14.36,7.36) v1(15.36,7.36) v1(16.36,7.36) v1(17.86,11.47) v1(17.86,9.69) v1(19.64,11.47) v1(19.64,9.69) v1(19.97,6.74) v1(20.97,6.74) v1(21.88,0.83) v1(31.36,13.36) v1(31.36,10.36) v1(31.36,7.36) v1(34.36,16.36) v1(35.36,16.36) v1(36.36,16.36) v1(37.78,12.03) v1(43.07,13.12) v1(43.07,12.48) v1(43.7,13.12) v1(45.06,11.65) v1(48.03,14.83) v1(48.03,12.61) v1(48.03,10.39) v1(50.24,14.83) v1(50.24,10.39) v1(51.36,7.36) v1(52.36,7.36) v1(52.46,14.83) v1(52.46,12.61) v1(52.46,10.39) v1(53.25,3.31) v1(53.25,2.31) v1(53.36,7.36) v1(54.25,3.31) v1(54.25,2.31) v1(54.39,9.15) v1(54.36,8.36) v1(54.36,7.36) v1(55.37,11.5) v1(55.36,9.36) v1(55.36,8.36) v1(55.36,7.36) v1(55.61,12.54) v1(56.4,12.5) v1(56.4,11.5) v1(56.36,9.36) v1(56.36,8.36) v1(56.36,7.36) v1(57.4,12.5) v1(57.4,11.5) v1(57.36,9.15) v1(57.36,8.36) v1(57.36,7.36) v1(58.4,12.5) v1(58.4,11.5) v1(58.36,9.36) v1(58.36,8.36) v1(58.36,7.36) v1(59.14,14.82) v1(59.14,13.82) v1(59.14,11.82) v1(59.13,8.96) v1(60.14,14.82) v1(60.14,13.82) v1(60.14,11.82) v1(60.12,8.89) v1(61.14,14.82) v1(61.14,13.82) v1(61.14,11.82) v1(61.12,8.89) v1(62.14,14.82) v1(62.14,13.82) v1(62.14,11.82) v1(62.12,8.89) v1(63.14,14.82) v1(63.14,13.82) v1(63.14,11.82) v1(63.12,8.89)
CC_CS: length 30
  Top Layer w0.254: U5.7 19.25,12.98 19.64,13.37 v1(20.79,13.37) ; v1(11.7,1.92) 10.62,3 H3.4
  Bottom Layer w0.254: v1(11.7,1.92) 13.56,1.92 14.71,3.07 22.2,3.07 23.74,4.6 23.74,9.85 22.33,11.26 22.33,13.05 22.01,13.37 v1(20.79,13.37)
CC_GDO0: length 18.5
  Top Layer w0.254: U5.6 19.84,12.68 v1(21.67,12.68) ; v1(22.94,12.68) 22.94,5.79 21.43,4.28 16.92,4.28 H3.6
  Inner2 w0.254: v1(22.94,12.68) v1(21.67,12.68)
CC_POWER: length 60.4
  Top Layer w0.254: v1(17.22,13.37) 16.75,12.9 U5.11 ; v1(18.27,13.5) 18.25,13.48 U5.9 ; SW3.3 19.39,0.7 14.46,0.7 14.01,1.15 6.64,1.15 R31.1 6.61,2.11 arc(6.6,2.15) Vcc_CC.1 ; U5.14 U5.15 16.75,8.52 v1(17.02,8.25) ; v1(22.56,14.2) 22.3,13.94 22.3,11.43 21.96,11.09 20.76,11.09 U5.4 ; v1(18.75,7.86) U5.18
  Top Layer w0.6: v1(22.56,14.2) 23.7,14.2 ; C23.1 25.84,14.2 C14.2 23.7,14.2 ; v1(28.15,6.97) 28.15,11.89
  Inner2 w0.6: v1(28.15,6.97) 22.97,1.79 SW3.3
  Bottom Layer w0.5: v1(17.22,13.37) 17.35,13.5 v1(18.27,13.5) 18.27,13.46 18.75,12.98 v1(18.75,7.86) 17.4,7.86 v1(17.02,8.25)
  Bottom Layer w0.6: v1(18.27,13.5) 18.97,14.2 v1(22.56,14.2)
CC_SCLK: length 19.7
  Top Layer w0.254: H3.5 13.16,3.08 v1(13.37,2.88) ; U5.1 21.06,9.58 v1(21.43,9.21)
  Inner2 w0.254: v1(13.37,2.88) 21.75,2.88 23.35,4.48 23.35,7.29 v1(21.43,9.21)
CC_SI: length 22.8
  Top Layer w0.254: v1(20.73,7.93) 20.09,7.93 19.75,8.27 U5.20
  Inner2 w0.254: H3.2 7.08,3.96 21.24,3.96 22.26,4.99 22.26,6.4 v1(20.73,7.93)
CC_SO: length 23.8
  Top Layer w0.254: v1(9.66,2.68) 8.08,4.26 H3.3 ; U5.2 21.78,10.08 v1(21.82,10.04)
  Bottom Layer w0.254: v1(21.82,10.04) 21.94,10.04 22.65,9.34 22.65,5.24 21.56,4.16 13.3,4.16 11.83,2.68 v1(9.66,2.68)
EN: length 22.4
  Top Layer w0.3: v1(39.7,13.89) 37.43,13.89 37.43,12.92 36.66,12.16 RESET.1 36.16,14.29 35.99,14.46 ; U4.9 54.26,13.86 v1(54.28,13.88)
  Inner2 w0.254: v1(54.28,13.88) 39.7,13.88 v1(39.7,13.89)
ESP_POWER: length 89.6
  Top Layer w0.254: 43.85,2.04 44.05,1.85 45.3,1.85 45.97,1.18 R33.1 57.69,2.1 arc(57.68,2.14) Vcc_ESP.1 ; U4.3 U4.4
  Top Layer w0.3: 53.67,8.67 U4.1 ; U4.4 54.09,11.36 54.84,12.11 54.84,15.64 v1(53.67,16.81) ; U4.37 47.48,9.17 47.48,8.57 47.88,8.17 v1(48.12,8.17) 47.63,7.68 C36.2 ; U4.46 51.99,8.52 51.64,8.17 ; U4.19 49.99,16.49 49.68,16.81 v1(49.28,16.81) ; v1(50.24,8.17) 50.49,8.42 U4.43
  Top Layer w0.35: 53.16,8.17 53.67,8.67
  Top Layer w0.4: v1(50.24,8.17) 53.16,8.17
  Top Layer w0.5: 43.35,16.85 43.39,16.81 43.39,15.6 ; 44.4,15.6 44.4,16.17 45.03,16.81 v1(45.35,16.81)
  Top Layer w0.6: 37.61,7.41 37.75,7.55 R24.2 ; 37.61,7.41 39.58,7.41 R29.1 R28.1 40.91,10.58 41.19,10.86 41.54,10.86 41.94,11.26 41.94,13.17 40.08,15.03 40.08,15.81 40,15.73 37.88,15.73 37.75,15.6 ; 37.61,7.41 v2(36.53,6.32) ; C9.2 44.4,15.6 40.23,15.6 40.12,15.71
  Bottom Layer w0.5: v1(50.24,8.17) v1(48.12,8.17) 47.63,8.17 46.14,9.66 46.14,16.02 v1(45.35,16.81) v1(49.28,16.81) 53.66,16.81 v1(53.67,16.81)
  Bottom Layer w0.6: v2(36.53,6.32) 36.53,4.55 37.5,3.58 43.26,3.58 43.85,2.98 43.85,2.04
GPIO0: length 19.6
  Top Layer w0.254: U4.23 48.01,16.05 48.01,16.41 47.65,16.76 46.52,16.76 45.37,15.61 45.37,13.32 v1(42.88,10.83)
  Top Layer w0.3: R24.1 37.43,10.03 BOOT.1 36.16,7.2 C28.2 ; v1(39.18,10.06) 37.78,10.06 37.75,10.03
  Inner2 w0.254: v1(39.18,10.06) 42.11,10.06 v1(42.88,10.83)
RX: length 10.8
  Top Layer w0.254: v1(45.43,9.95) 45.41,9.97 44.31,9.97 44.27,10.01 ; H2.5 48.72,7.02 48.99,7.3 U4.40
  Inner2 w0.254: H2.5 45.43,8.79 v1(45.43,9.95)
TX: length 16.3
  Top Layer w0.254: U4.41 49.49,7.27 H2.6 ; 44.27,8.74 44.15,8.63 v1(44.15,7.87)
  Inner2 w0.254: H2.6 49.6,3.84 45.69,3.84 44.92,4.6 44.92,7.1 v1(44.15,7.87)
$1N19: length 1.5
  Top Layer w0.254: 43.25,10.01 R28.2
$1N20: length 1.5
  Top Layer w0.254: 43.25,8.74 R29.2
$1N3299: length 5.5
  Top Layer w0.315: L9.1 57.39,10.36 C12.2 61.72,10.35
  Top Layer w0.35: 61.72,10.35 RF3.5
$1N3304: length 2.1
  Top Layer w0.315: U4.2 54.7,10.36 C35.2 55.71,10.35 L9.2
$1N4251: length 1.3
  Top Layer w0.254: LED4.2 R31.2
$1N4890: length 6.3
  Top Layer w0.254: 22.14,16.41 20.31,16.41 19.32,15.42 19.32,13.82 18.77,13.27 18.77,12.61 U5.8
$1N4895: length 3.9
  Top Layer w0.254: 16.76,15.32 17.18,15.32 17.78,14.72 18.14,14.72 17.75,14.33 U5.10
$1N5338: length 1.7
  Top Layer w0.254: 18.24,7.11 R32.1 18.04,7.31 18.04,7.93 18.25,8.14 U5.17
$1N5430: length 3.8
  Top Layer w0.254: U5.5 21.11,11.58 21.44,11.91 v1(21.67,11.91) ; 24.27,11.6 23.95,11.91 v1(23.51,11.91)
  Inner2 w0.254: v1(23.51,11.91) v1(21.67,11.91)
$1N5564: length 3.6
  Top Layer w0.315: 13.83,9.44 15.16,9.44 15.19,9.47 15.19,9.82 15.95,10.58 U5.13
$1N5647: length 2.6
  Top Layer w0.315: 12.74,9.44 12.74,10.65 12.69,10.71 12.74,10.76 12.74,11.98
$1N5692: length 2.8
  Top Layer w0.315: C32.1 10.87,10.75 10.83,10.71 ; 10.15,10.71 10.83,10.71 ; 10.83,10.71 11.6,10.71
$1N5734: length 3.5
  Top Layer w0.315: 13.83,11.98 15.1,11.98 15.19,12.07 15.19,11.84 15.95,11.08 U5.12
$1N5764: length 2.8
  Top Layer w0.315: 7.61,10.58 8.02,10.58 arc(8.08,10.59) 8.12,10.62 arc(8.22,10.68) 8.33,10.71 ; 8.33,10.71 9.06,10.71 ; 8.33,10.71 arc(8.33,10.7) 8.33,10.7 ; 8.34,9.35 8.34,10.7
$1N6120: length 3.8
  Top Layer w0.315: 6.52,10.58 5.59,10.58 arc(5.54,10.57) 5.5,10.54 arc(5.26,10.38) 4.98,10.33 RF4.5
$1N6387: length 1.3
  Top Layer w0.254: R33.2 LED5.2
$1N20620: length 1.5
  Top Layer w0.3: 15.1,13.08 15.1,14.56
$1N27764: length 0.8
  Top Layer w0.254: SDIO.1 46.09,14.86 U4.26
$1N27806: length 0.9
  Top Layer w0.254: 50.48,16.91 50.49,16.91 U4.18

## Copper pours and planes (outline as drawn; the poured copper is in the pictures)
GND on Top Layer: -0.68,18.64 65.99,18.64 65.99,-1.42 -0.68,-1.42
GND on Bottom Layer: -6.66,25.28 72.25,25.28 72.25,-9.99 -6.66,-9.99
GND on Bottom Layer: -1.57,20.49 68.41,20.49 68.41,-4.41 -1.57,-4.41
GND on Inner1: -3.34,22.72 68.15,22.72 68.15,-4.74 -3.34,-4.74
GND on Inner2: -7.56,27.9 70.26,27.9 70.26,-5.12 -7.56,-5.12

Small or netless copper shapes (teardrops, artwork), in the pictures only: 4 on Top Layer

## Text on the board
Bottom Silkscreen Layer: CC1101 / Interface | ESP32 / Interface | SI | SO | CS | SCLK | GDO0 | GND | 3.3V | RX | TX
Top Silkscreen Layer: Rev 2.1 | TwinWave | OFF | ON | 433MHz | 2.4 / GHz | Sub-GHz | WiFi
